# Altium schematic sheet Digital_Chip_Counter.SchDoc
size 381 x 241 mm
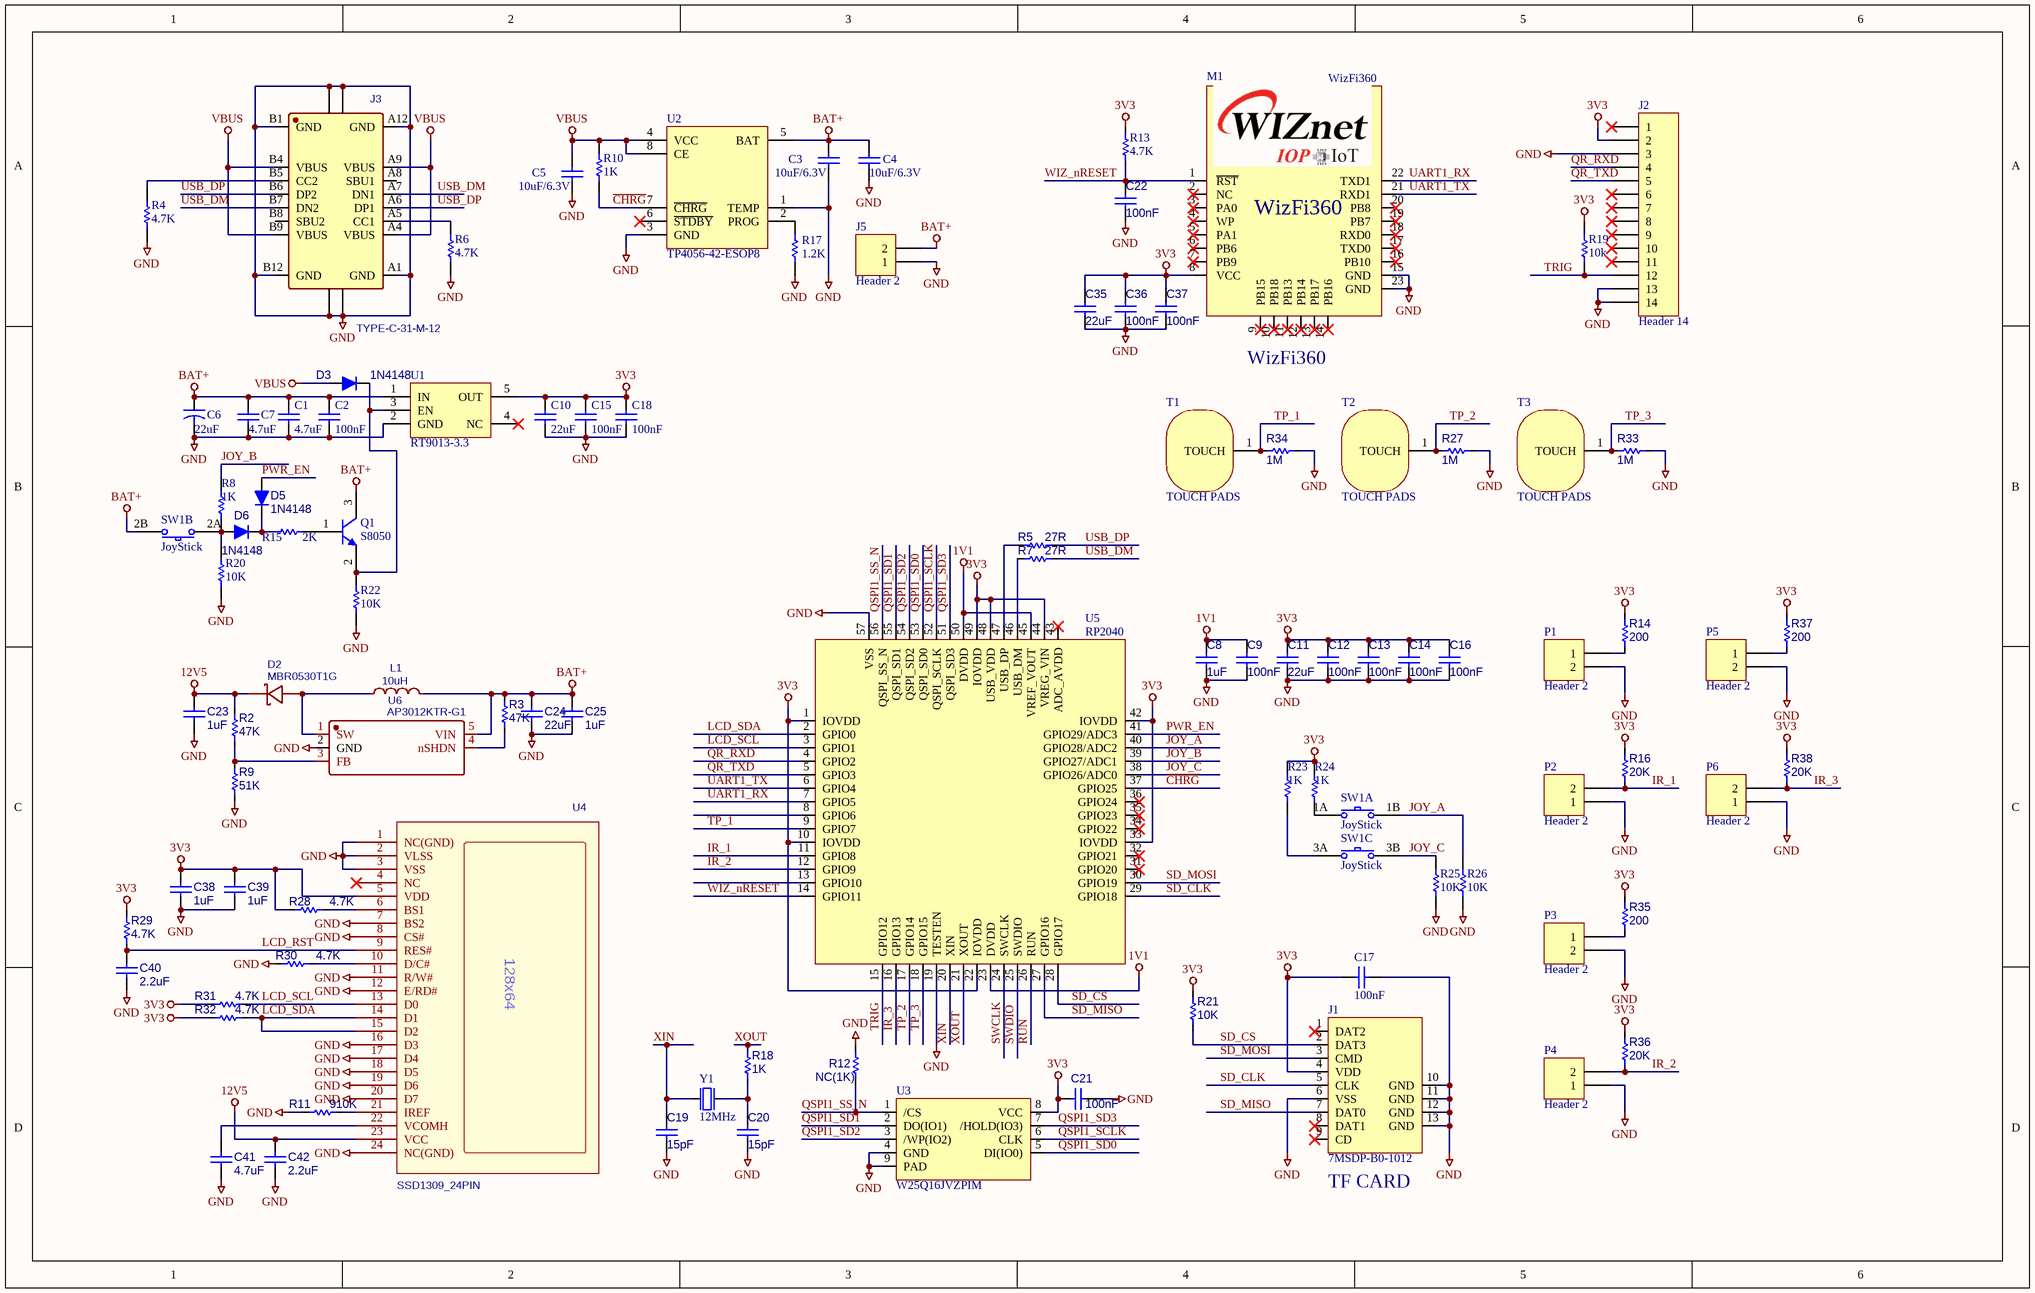
[diagram p0: Digital_Chip_Counter.SchDoc]

## Parts
C1  value 4.7uF  [0603-C]  (hidden comment: Cap)
C2  value 100nF  [0603-C]  (hidden comment: Cap)
C3  value 10uF/6.3V  [1206-C]  (hidden comment: Cap)
C4  value 10uF/6.3V  [1206-C]  (hidden comment: Cap)
C5  value 10uF/6.3V  [1206-C]  (hidden comment: Cap)
C6  value 22uF  [0603-C]  (hidden comment: Cap2)
C7  value 4.7uF  [0603-C]  (hidden comment: Cap)
C8  1uF  [0603-C]
C9  100nF  [0603-C]
C10  value 22uF  [0603-C]  (hidden comment: Cap)
C11  22uF  [0603-C]
C12  100nF  [0603-C]
C13  100nF  [0603-C]
C14  100nF  [0603-C]
C15  value 100nF  [0603-C]  (hidden comment: Cap)
C16  100nF  [0603-C]
C17  100nF  [0603-C]
C18  value 100nF  [0603-C]  (hidden comment: Cap)
C19  15pF  [0603-C]
C20  15pF  [0603-C]
C21  100nF  [0603-C]
C22  100nF  [0603-C]
C23  1uF  [0603-C]
C24  22uF  [0603-C]
C25  1uF  [0603-C]
C35  22uF  [0603-C]
C36  100nF  [0603-C]
C37  100nF  [0603-C]
C38  1uF  [0603-C]
C39  1uF  [0603-C]
C40  2.2uF  [0603-C]
C41  4.7uF  [0603-C]
C42  2.2uF  [0603-C]
D2  MBR0530T1G  [SOD-123]
D3  1N4148  [SOD-323(1-C,2-A)]
D5  1N4148  [SOD-323(1-C,2-A)]
D6  1N4148  [SOD-323(1-C,2-A)]
J1  7MSDP-B0-1012  [7MSDP-B0-1012]
J2  Header 14  [FPC-12PIN]
J3  TYPE-C-31-M-12  [USB-C_SMT-TYPE-C-31-M-12]
J5  Header 2  [1X2螺丝端子(3.81mm间距)]
L1  10uH  [Inductor SMD 3x3]
M1  WizFi360  [WIZFI360-PA]
P1  Header 2  [HDR1X2]
P2  Header 2  [HDR1X2]
P3  Header 2  [HDR1X2]
P4  Header 2  [HDR1X2]
P5  Header 2  [HDR1X2]
P6  Header 2  [HDR1X2]
Q1  S8050  [SOT23]
R2  47K  [0603-R]
R3  47K  [0603-R]
R4  value 4.7K  [0603-R]  (hidden comment: Res1)
R5  27R  [0603-R]
R6  value 4.7K  [0603-R]  (hidden comment: Res1)
R7  27R  [0603-R]
R8  value 1K  [0603-R]  (hidden comment: Res1)
R9  51K  [0603-R]
R10  value 1K  [0603-C]  (hidden comment: Res1)
R11  910K  [0603-R]
R12  NC(1K)  [0603-R]
R13  4.7K  [0603-C]
R14  200  [0603-R]
R15  value 2K  [0603-R]  (hidden comment: Res1)
R16  20K  [0603-R]
R17  value 1.2K  [0603-C]  (hidden comment: Res1)
R18  1K  [0603-R]
R19  value 10k  [0603-R]  (hidden comment: Res1)
R20  value 10K  [0603-R]  (hidden comment: Res1)
R21  10K  [0603-R]
R22  value 10K  [0603-R]  (hidden comment: Res1)
R23  value 1K  [0603-R]  (hidden comment: Res1)
R24  value 1K  [0603-R]  (hidden comment: Res1)
R25  value 10K  [0603-R]  (hidden comment: Res1)
R26  value 10K  [0603-R]  (hidden comment: Res1)
R27  1M  [0603-R]
R28  4.7K  [0603-R]
R29  4.7K  [0603-R]
R30  4.7K  [0603-R]
R31  4.7K  [0603-R]
R32  4.7K  [0603-R]
R33  1M  [0603-R]
R34  1M  [0603-R]
R35  200  [0603-R]
R36  20K  [0603-R]
R37  200  [0603-R]
R38  20K  [0603-R]
SW1  JoyStick  [JoyStick]  (parts A,B,C of 3)
T1  TOUCH PADS  [Touch PADS]
T2  TOUCH PADS  [Touch PADS]
T3  TOUCH PADS  [Touch PADS]
U1  RT9013-3.3  [SOT-23-5]
U2  TP4056-42-ESOP8  [ESOP-8]
U3  W25Q16JVZPIM  [WSON8(6X5_1.27)]
U4  SSD1309_24PIN  [FPC_24PIN]
U5  RP2040  [QFN56(0.4/7X7)]
U6  AP3012KTR-G1  [SOT23-5]
Y1  12MHz  [OSC-TZ1067B]

## Nets
1V1: C8.2 C9.2 U5.23(DVDD) U5.45(VREF_VOUT) U5.50(DVDD)
3V3: C10.2 C11.2 C12.2 C13.2 C14.2 C15.2 C16.2 C17.2 C18.2 C21.2 C35.2 C36.2 C37.2 C38.1 C39.1 J1.4(VDD) J2.2 M1.8(VCC) R13.2 R14.2 R16.2 R19.2 R21.1 R23.1 R24.1 R28.1 R29.2 R31.1 R32.1 R35.2 R36.2 R37.2 R38.2 U1.5(OUT) U3.8(VCC) U4.5(VDD) U5.1(IOVDD) U5.10(IOVDD) U5.22(IOVDD) U5.33(IOVDD) U5.42(IOVDD) U5.44(VREG_VIN) U5.48(USB_VDD) U5.49(IOVDD)
12V5: C23.1 C42.1 D2.1(C) R2.2 U4.23(VCC)
BAT+: C1.2 C2.2 C3.1 C4.1 C6.1 C7.1 C24.1 C25.1 J5.2 L1.2 Q1.3(C) R3.2 SW1.2B U1.1(IN) U2.5(BAT) U6.5(VIN)
GND: C1.1 C2.1 C3.2 C4.2 C5.2 C6.2 C7.2 C8.1 C9.1 C10.1 C11.1 C12.1 C13.1 C14.1 C15.1 C16.1 C17.1 C18.1 C19.2 C20.2 C21.1 C22.1 C23.2 C24.2 C25.2 C35.1 C36.1 C37.1 C38.2 C39.2 C40.2 C41.2 C42.2 J1.6(VSS) J1.10(GND) J1.11(GND) J1.12(GND) J1.13(GND) J2.3 J2.13 J2.14 J3.1 J3.2 J3.3 J3.4 J3.A1(GND) J3.A12(GND) J3.B1(GND) J3.B12(GND) J5.1 M1.15(GND) M1.23(GND) P1.2 P2.1 P3.2 P4.1 P5.2 P6.1 R4.1 R6.1 R9.1 R11.1 R12.2 R17.1 R20.2 R22.2 R25.2 R26.2 R27.1 R30.2 R33.1 R34.1 U1.2(GND) U2.1(TEMP) U2.3(GND) U3.4(GND) U3.9(PAD) U4.1(NC(GND)) U4.2(VLSS) U4.3(VSS) U4.7(BS2) U4.8(CS#) U4.11(R/W#) U4.12(E/RD#) U4.16(D3) U4.17(D4) U4.18(D5) U4.19(D6) U4.20(D7) U4.24(NC(GND)) U5.19(TESTEN) U5.57(VSS) U6.2(GND) Y1.2 Y1.4
VBUS: C5.1 D3.2(A) J3.A4(VBUS) J3.A9(VBUS) J3.B4(VBUS) J3.B9(VBUS) R10.1 U2.4(VCC) U2.8(CE)
~{CHRG}: R10.2 U2.7(~{CHRG}) U5.37(GPIO25)
IR_1: P2.2 R16.1 U5.11(GPIO8)
IR_2: P4.2 R36.1 U5.12(GPIO9)
IR_3: P6.2 R38.1 U5.16(GPIO13)
JOY_A: R26.1 SW1.1B U5.40(GPIO28/ADC2)
JOY_B: R8.1 U5.39(GPIO27/ADC1)
JOY_C: R25.1 SW1.3B U5.38(GPIO26/ADC0)
LCD_RST: C40.1 R29.1 U4.9(RES#)
LCD_SCL: R31.2 U4.13(D0) U5.3(GPIO1)
LCD_SDA: R32.2 U4.14(D1) U4.15(D2) U5.2(GPIO0)
PWR_EN: D5.2(A) U5.41(GPIO29/ADC3)
QR_RXD: J2.4 U5.4(GPIO2)
QR_TXD: J2.5 U5.5(GPIO3)
QSPI1_SCLK: U3.6(CLK) U5.52(QSPI_SCLK)
QSPI1_SD0: U3.5(DI(IO0)) U5.53(QSPI_SD0)
QSPI1_SD1: U3.2(DO(IO1)) U5.55(QSPI_SD1)
QSPI1_SD2: U3.3(/WP(IO2)) U5.54(QSPI_SD2)
QSPI1_SD3: U3.7(/HOLD(IO3)) U5.51(QSPI_SD3)
QSPI1_SS_N: R12.1 U3.1(/CS) U5.56(QSPI_SS_N)
RUN: U5.26(RUN)
SD_CLK: J1.5(CLK) U5.29(GPIO18)
SD_CS: J1.2(DAT3) R21.2 U5.28(GPIO17)
SD_MISO: J1.7(DAT0) U5.27(GPIO16)
SD_MOSI: J1.3(CMD) U5.30(GPIO19)
SWCLK: U5.24(SWCLK)
SWDIO: U5.25(SWDIO)
TP_1: R34.2 T1.1(TOUCH) U5.9(GPIO7)
TP_2: R27.2 T2.1(TOUCH) U5.17(GPIO14)
TP_3: R33.2 T3.1(TOUCH) U5.18(GPIO15)
TRIG: J2.12 R19.1 U5.15(GPIO12)
UART1_RX: M1.22(TXD1) U5.7(GPIO5)
UART1_TX: M1.21(RXD1) U5.6(GPIO4)
USB_DM: J3.A7(DN1) J3.B7(DN2) R7.1
USB_DP: J3.A6(DP1) J3.B6(DP2) R5.1
WIZ_nRESET: C22.2 M1.1(~{RST}) R13.1 U5.14(GPIO11)
XIN: C19.1 U5.20(XIN) Y1.1(inp)
XOUT: R18.2 U5.21(XOUT)
NetC20_1: C20.1 R18.1 Y1.3(out)
NetC41_1: C41.1 U4.22(VCOMH)
NetD2_2: D2.2(A) L1.1 U6.1(SW)
NetD3_1: D3.1(K) Q1.2(E) R22.1 U1.3(EN)
NetD5_1: D5.1(K) D6.1(K) R15.1
NetD6_2: D6.2(A) R8.2 R20.1 SW1.2A
NetJ3_A5: J3.A5(CC1) R6.2
NetJ3_B5: J3.B5(CC2) R4.2
NetP1_1: P1.1 R14.1
NetP3_1: P3.1 R35.1
NetP5_1: P5.1 R37.1
NetQ1_1: Q1.1(B) R15.2
NetR2_1: R2.1 R9.2 U6.3(FB)
NetR3_1: R3.1 U6.4(nSHDN)
NetR5_2: R5.2 U5.47(USB_DP)
NetR7_2: R7.2 U5.46(USB_DM)
NetR11_2: R11.2 U4.21(IREF)
NetR17_2: R17.2 U2.2(PROG)
NetR23_2: R23.2 SW1.3A
NetR24_2: R24.2 SW1.1A
NetR28_2: R28.2 U4.6(BS1)
NetR30_1: R30.1 U4.10(D/C#)

Not connected (* = marked no-connect by the designer): J1 1(DAT2)* 8(DAT1)* 9(CD)*; J2 1* 6* 7* 8* 9* 10* 11*; J3 A8(SBU1) B8(SBU2); M1 2(NC)* 3(PA0)* 4(WP)* 5(PA1)* 6(PB6)* 7(PB9)* 9(PB15)* 10(PB18)* 11(PB13)* 12(PB14)* 13(PB17)* 14(PB16)* 16(PB10)* 17(TXD0)* 18(RXD0)* 19(PB7)* 20(PB8)*; U1 4(NC)*; U2 6(~{STDBY})*; U4 4(NC)*; U5 8(GPIO6) 13(GPIO10) 31(GPIO20)* 32(GPIO21)* 34(GPIO22)* 35(GPIO23)* 36(GPIO24)* 43(ADC_AVDD)*

## Notes on the sheet
- (near M1) WizFi360
- (near J1) TF CARD
- (in symbol SSD1306_24PIN) 128x64

## Library data of the parts
C1-C5 C7 C10 C15 C18 = Cap: Capacitor; Published: 8-Jun-2000; LatestRevisionDate: 17-Jul-2002; LatestRevisionNote: Re-released for DXP Platform.; Publisher: Altium Limited
  C1 C2 C7 C10 C15 C18: PackageReference: RAD-0.3
C6 = Cap2: Capacitor; Published: 23-Sep-2002; Publisher: Altium Limited
C8 C9 C11-C14 C16 C19-C25 C36-C42 = CAP-0402: Ceramic CAP 0402(1005)
C17 = CAP-0603: Ceramic CAP 0603(1608)
C35 = CAP-0805: Ceramic CAP 0805(2012)
D2 = MBR0530T1G: Manufacturer: ON; Supplier: LCSC; Manufacturer Part: MBR0530T1G; Supplier Part: C82046; JLCPCB Part Class: Extended Part; spicePre: D; spiceSymbolName: MBR0530T1G
D3 D5 D6 = DIODE-BAT60A: Silicon Schottky Diode
J1 = 7MSDP-B0-1012: Micro SD Card Socket
J2 = Header 14: Header, 14-Pin; LatestRevisionDate: 17-Jul-2002; LatestRevisionNote: Re-released for DXP Platform.; Publisher: Altium Limited
J3 = TYPE-C-31-M-12: BOM_Manufacturer: Rectangular Connectors - Contacts; Contributor: LCSC; BOM_Supplier: LCSC; BOM_Supplier Part: C165948; BOM_Manufacturer Part: TYPE-C-31-M-12; spicePre: U; spiceSymbolName: TYPE-C-31-M-12
J5 P1-P6 = Header 2: Header, 2-Pin; LatestRevisionDate: 17-Jul-2002; LatestRevisionNote: Re-released for DXP Platform.; Publisher: Altium Limited
L1 = 10uH: Manufacturer: Sunlord; Manufacturer Part: SWPA3012S100MT; nameAlias: Inductance; Supplier: LCSC; Supplier Part: C48668; JLCPCB Part Class: Extended Part; spicePre: L; spiceSymbolName: SWPA3012S100MT
Q1 = 8050: NPN General Purpose Amplifier; Published: 8-Jun-2000; LatestRevisionDate: 15-Jan-2003; LatestRevisionNote: PCB Footprint 'BCY-W3/D4.7' replaced; DatasheetDocument: 1997; PackageDocument: Sep-1998; PackageReference: TO-92A; Publisher: Altium Limited; Code_JEDEC: TO-92A; ComponentLink1Description: Manufacturer Link; ComponentLink1URL: http://www.fairchildsemi.com/; ComponentLink2Description: Datasheet; ComponentLink2URL: http://www.fairchildsemi.com/ds/2N%2F2N3904.pdf
R2 R3 R5 R7 R9 R11 R12 R14 R16 R18 R21 R27-R38 = RES-0402: 0603-R
R4 R6 R8 R10 R15 R17 R19 R20 R22-R26 = Res1: Resistor; Published: 8-Jun-2000; LatestRevisionDate: 17-Jul-2002; LatestRevisionNote: Re-released for DXP Platform.; PackageReference: AXIAL-0.3; Publisher: Altium Limited
  R10 R17: PackageDescription: Axial Device, Thru-Hole; 2 Leads; 0.3 in Pin Spacing
R13 = RES-0402
U2 = TP4056
U3 = W25Q16JVZPIM: 3V 16M-BIT / SERIAL FLASH MEMORY WITH / DUAL/QUAD SPI, QPI & DTR
U4 = SSD1306_24PIN: Contributor: AuAuAu; spicePre: U; spiceSymbolName: C2890607
U5 = RP2040: Raspverry Pi, Dual ARM Cortex-M0+ @ 133MHz
U6 = AP3012KTR-G1: Manufacturer: Diodes Incorporated; Contributor: LCSC; Supplier: LCSC; Supplier Part: C102618; Manufacturer Part: AP3012KTR-G1; JLCPCB Part Class: Extended Part; spicePre: U; spiceSymbolName: AP3012KTR-G1
Y1 = OSC-TZ1067B-12MHz: X-tal 12MHz,3.2x2.5 SMD, CL=20pF